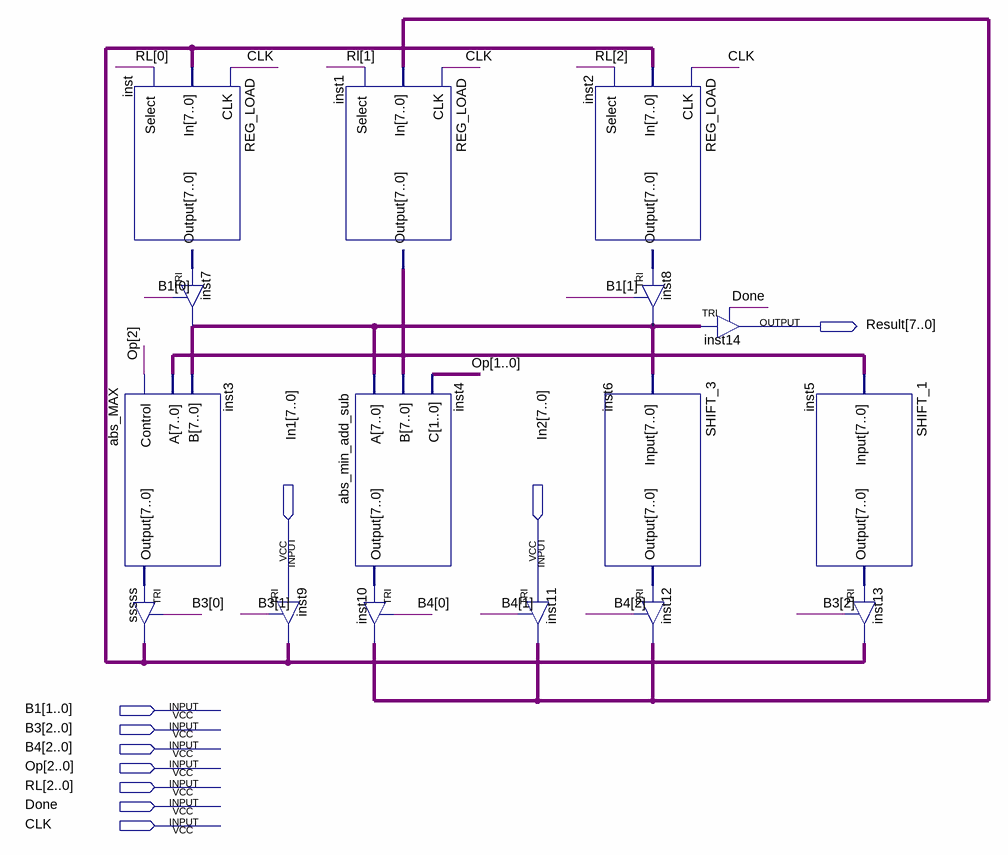
[diagram p0: schematic sheet]
// Quartus schematic Datapath_ver4.bdf as structural Verilog: 16 symbols, 10 pins
module Datapath_ver4 (
  input  [7:0] In1,
  input  [7:0] In2,
  input  [1:0] B1,
  input  [2:0] B3,
  input  [2:0] B4,
  input  [2:0] Op,
  input  [2:0] RL,
  input  Done,
  input  CLK,
  output [7:0] Result
);

  wire [7:0] inst1_output, inst2_output, inst3_output, inst4_output, inst5_output, inst6_output, inst7_out,
       inst10_out, inst_output, sssss_out;

  abs_MAX inst3 (.Control(Op[2]), .A(inst1_output), .B(inst7_out), .Output(inst3_output));
  REG_LOAD inst (.CLK(CLK), .In(sssss_out), .Select(RL[0]), .Output(inst_output));
  TRI inst7[7:0] (.IN(inst_output), .OE(B1[0]), .OUT(inst7_out));
  TRI sssss[7:0] (.IN(inst3_output), .OE(B3[0]), .OUT(sssss_out));
  REG_LOAD inst1 (.CLK(CLK), .In(inst10_out), .Select(RL[1]), .Output(inst1_output));
  abs_min_add_sub inst4 (.A(inst7_out), .B(inst1_output), .C(Op[1:0]), .Output(inst4_output));
  TRI inst9[7:0] (.IN(In1), .OE(B3[1]), .OUT(sssss_out));
  TRI inst10[7:0] (.IN(inst4_output), .OE(B4[0]), .OUT(inst10_out));
  TRI inst11[7:0] (.IN(In2), .OE(B4[1]), .OUT(inst10_out));
  REG_LOAD inst2 (.CLK(CLK), .In(sssss_out), .Select(RL[2]), .Output(inst2_output));
  TRI inst8[7:0] (.IN(inst2_output), .OE(B1[1]), .OUT(inst7_out));
  SHIFT_3 inst6 (.Input(inst7_out), .Output(inst6_output));
  TRI inst12[7:0] (.IN(inst6_output), .OE(B4[2]), .OUT(inst10_out));
  TRI inst14[7:0] (.IN(inst7_out), .OE(Done), .OUT(Result));
  SHIFT_1 inst5 (.Input(inst1_output), .Output(inst5_output));
  TRI inst13[7:0] (.IN(inst5_output), .OE(B3[2]), .OUT(sssss_out));
endmodule
